# Altium schematic sheet STM32 Schematic V1.SchDoc
size B
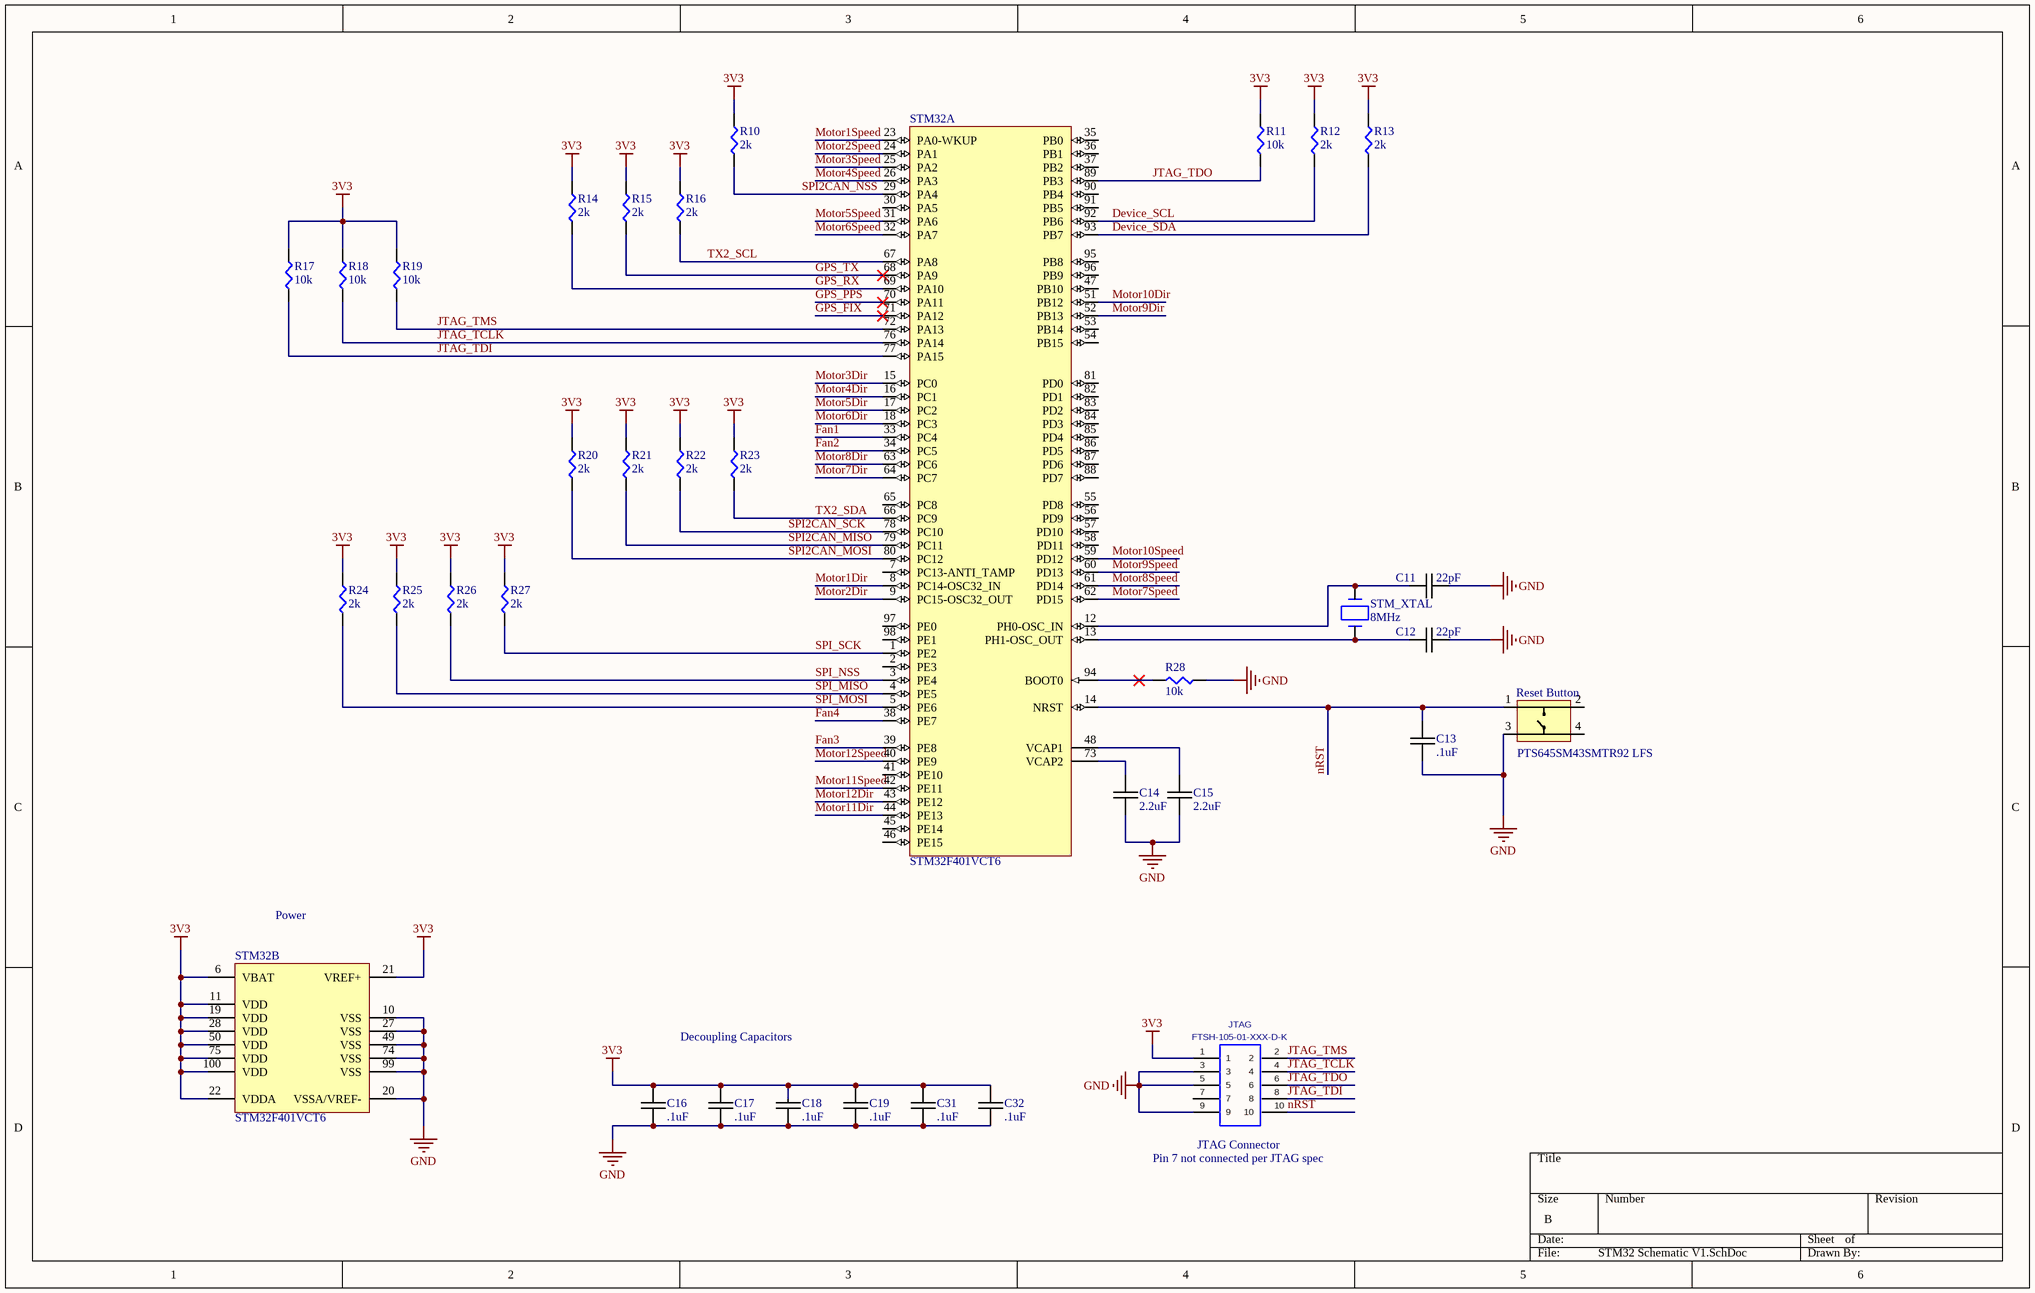
[diagram p0: STM32 Schematic V1.SchDoc]

## Parts
C11  22pF  [0805C-GENERIC]
C12  22pF  [0805C-GENERIC]
C13  .1uF  [0805C-GENERIC]
C14  2.2uF  [0805C-GENERIC]
C15  2.2uF  [0805C-GENERIC]
C16  .1uF  [0805C-GENERIC]
C17  .1uF  [0805C-GENERIC]
C18  .1uF  [0805C-GENERIC]
C19  .1uF  [0805C-GENERIC]
C31  .1uF  [0805C-GENERIC]
C32  .1uF  [0805C-GENERIC]
JTAG  FTSH-105-01-XXX-D-K  [FTSH-105-01-XXX-D-K]
R10  2k  [0805R-GENERIC]
R11  10k  [0805R-GENERIC]
R12  2k  [0805R-GENERIC]
R13  2k  [0805R-GENERIC]
R14  2k  [0805R-GENERIC]
R15  2k  [0805R-GENERIC]
R16  2k  [0805R-GENERIC]
R17  10k  [0805R-GENERIC]
R18  10k  [0805R-GENERIC]
R19  10k  [0805R-GENERIC]
R20  2k  [0805R-GENERIC]
R21  2k  [0805R-GENERIC]
R22  2k  [0805R-GENERIC]
R23  2k  [0805R-GENERIC]
R24  2k  [0805R-GENERIC]
R25  2k  [0805R-GENERIC]
R26  2k  [0805R-GENERIC]
R27  2k  [0805R-GENERIC]
R28  10k  [0805R-GENERIC]
Reset_Button  PTS645SM43SMTR92 LFS  [PTS645SM43SMTR92 LFS]
STM32  STM32F401VCT6  [STM-LQFP100_V]  (parts A,B of 2)
STM_XTAL  8MHz  [GC0800044]

## Nets
3V3: C16.1 C17.1 C18.1 C19.1 C31.1 C32.1 JTAG.1 R10.1 R11.1 R12.1 R13.1 R14.1 R15.1 R16.1 R17.1 R18.1 R19.1 R20.1 R21.1 R22.1 R23.1 R24.1 R25.1 R26.1 R27.1 STM32.6(VBAT) STM32.11(VDD) STM32.19(VDD) STM32.21(VREF+) STM32.22(VDDA) STM32.28(VDD) STM32.50(VDD) STM32.75(VDD) STM32.100(VDD)
GND: C11.2 C12.2 C13.2 C14.2 C15.2 C16.2 C17.2 C18.2 C19.2 C31.2 C32.2 JTAG.3 JTAG.5 JTAG.9 R28.2 Reset_Button.3 STM32.10(VSS) STM32.20(VSSA/VREF-) STM32.27(VSS) STM32.49(VSS) STM32.74(VSS) STM32.99(VSS)
Device_SCL: R12.2 STM32.92(PB6)
Device_SDA: R13.2 STM32.93(PB7)
Fan1: STM32.33(PC4)
Fan2: STM32.34(PC5)
Fan3: STM32.39(PE8)
Fan4: STM32.38(PE7)
GPS_FIX: STM32.71(PA12)
GPS_PPS: STM32.70(PA11)
GPS_RX: R14.2 STM32.69(PA10)
GPS_TX: R15.2 STM32.68(PA9)
JTAG_TCLK: JTAG.4 R18.2 STM32.76(PA14)
JTAG_TDI: JTAG.8 R17.2 STM32.77(PA15)
JTAG_TDO: JTAG.6 R11.2 STM32.89(PB3)
JTAG_TMS: JTAG.2 R19.2 STM32.72(PA13)
Motor1Dir: STM32.8(PC14-OSC32_IN)
Motor1Speed: STM32.23(PA0-WKUP)
Motor2Dir: STM32.9(PC15-OSC32_OUT)
Motor2Speed: STM32.24(PA1)
Motor3Dir: STM32.15(PC0)
Motor3Speed: STM32.25(PA2)
Motor4Dir: STM32.16(PC1)
Motor4Speed: STM32.26(PA3)
Motor5Dir: STM32.17(PC2)
Motor5Speed: STM32.31(PA6)
Motor6Dir: STM32.18(PC3)
Motor6Speed: STM32.32(PA7)
Motor7Dir: STM32.64(PC7)
Motor7Speed: STM32.62(PD15)
Motor8Dir: STM32.63(PC6)
Motor8Speed: STM32.61(PD14)
Motor9Dir: STM32.52(PB13)
Motor9Speed: STM32.60(PD13)
Motor10Dir: STM32.51(PB12)
Motor10Speed: STM32.59(PD12)
Motor11Dir: STM32.44(PE13)
Motor11Speed: STM32.42(PE11)
Motor12Dir: STM32.43(PE12)
Motor12Speed: STM32.40(PE9)
nRST: C13.1 JTAG.10 Reset_Button.1 STM32.14(NRST)
SPI2CAN_MISO: R21.2 STM32.79(PC11)
SPI2CAN_MOSI: R20.2 STM32.80(PC12)
SPI2CAN_NSS: R10.2 STM32.29(PA4)
SPI2CAN_SCK: R22.2 STM32.78(PC10)
SPI_MISO: R25.2 STM32.4(PE5)
SPI_MOSI: R24.2 STM32.5(PE6)
SPI_NSS: R26.2 STM32.3(PE4)
SPI_SCK: R27.2 STM32.1(PE2)
TX2_SCL: R16.2 STM32.67(PA8)
TX2_SDA: R23.2 STM32.66(PC9)
NetC11_1: C11.1 STM32.12(PH0-OSC_IN) STM_XTAL.1
NetC12_1: C12.1 STM32.13(PH1-OSC_OUT) STM_XTAL.2
NetC14_1: C14.1 STM32.73(VCAP2)
NetC15_1: C15.1 STM32.48(VCAP1)
NetR28_1: R28.1 STM32.94(BOOT0)

Not connected (* = marked no-connect by the designer): JTAG 7; Reset_Button 2 4; STM32 2(PE3) 7(PC13-ANTI_TAMP) 30(PA5) 35(PB0) 36(PB1) 37(PB2) 41(PE10) 45(PE14) 46(PE15) 47(PB10) 53(PB14) 54(PB15) 55(PD8) 56(PD9) 57(PD10) 58(PD11) 65(PC8) 81(PD0) 82(PD1) 83(PD2) 84(PD3) 85(PD4) 86(PD5) 87(PD6) 88(PD7) 90(PB4) 91(PB5) 95(PB8) 96(PB9) 97(PE0) 98(PE1)

## Notes on the sheet
- Power
- Decoupling Capacitors
- (near JTAG) Pin 7 not connected per JTAG spec
- (near JTAG) JTAG Connector

## Library data of the parts
C11-C19 C31 C32 = 0805C-TBD: CAPACITOR 0805 CERAMIC VALUE TO BE DETERMINED
JTAG = FTSH-105-01-XXX-D-K: TERMINAL STRIP, .050"(1.27mm) PITCH, 10 PINS, KEYING OPTION.; MANUFACTURER: SAMTEC; CREATED: September 26, 2016 - Wendy Xin; PCB DECAL: FTSH-105-01-XXX-D-K
R10-R28 = 0805R-TBD: RESISTOR 0805 VALUE TO BE DETERMINED
STM32 = STM32F401VCT6: ARM Cortex-M4 32-bit MCU+FPU, 105 DMIPS, 256 kB Flash, 64 kB Internal RAM, 79 I/Os, 100-pin LQFP, -40 to 85 degC, Tray; Manufacturer: STMicroelectronics; FLASH Size (Prog) (kB): 256; I/Os (High Current): 79; Internal RAM Size (kB): 64; Operating Frequency(F) (Processor speed) (MHz): 84; Supply Voltage(Vcc) max (V): 3.6; Supply Voltage(Vcc) min (V): 1.8; DatasheetVersion: Rev. 1; PackageVersion: Rev. 1, 06/2013; PackageReference: LQFP100; PackageDescription: 100-Pin Low Profile Quad Flat Package, 14 x 14 mm Body, 0.5 mm Pitch; Supplier 1: Digi-Key; Supplier Part Number 1: 497-14048-ND; Supplier 2: Newark; Supplier Part Number 2: 19X6223; Supplier 3: Mouser; Supplier Part Number 3: 511-STM32F401VCT6; Core: ARM Cortex-M4; Packing: Tray; Mounting Technology: Surface Mount; PartNumber: STM32F401VCT6; ComponentLink1Description: Manufacturer URL; ComponentLink1URL: http://www.st.com/web/en/home.html; ComponentLink2Description: Datasheet; ComponentLink2URL: http://www.st.com/st-web-ui/static/active/en/resource/technical/document/data_brief/DM00071938.pdf; ComponentLink3Description: Package Specification; ComponentLink3URL: http://www.st.com/st-web-ui/static/active/en/resource/technical/document/data_brief/DM00071938.pdf
STM_XTAL = GC0800044: Diodes Incorporated GC0800044; Supplier 1: Digi-Key; Supplier Part Number 1: GC0800044TR-ND